# Altium schematic sheet RK3566_FLASH_SD_SARADC.SchDoc
size A3; SheetNumber: 17; SheetTotal: 20
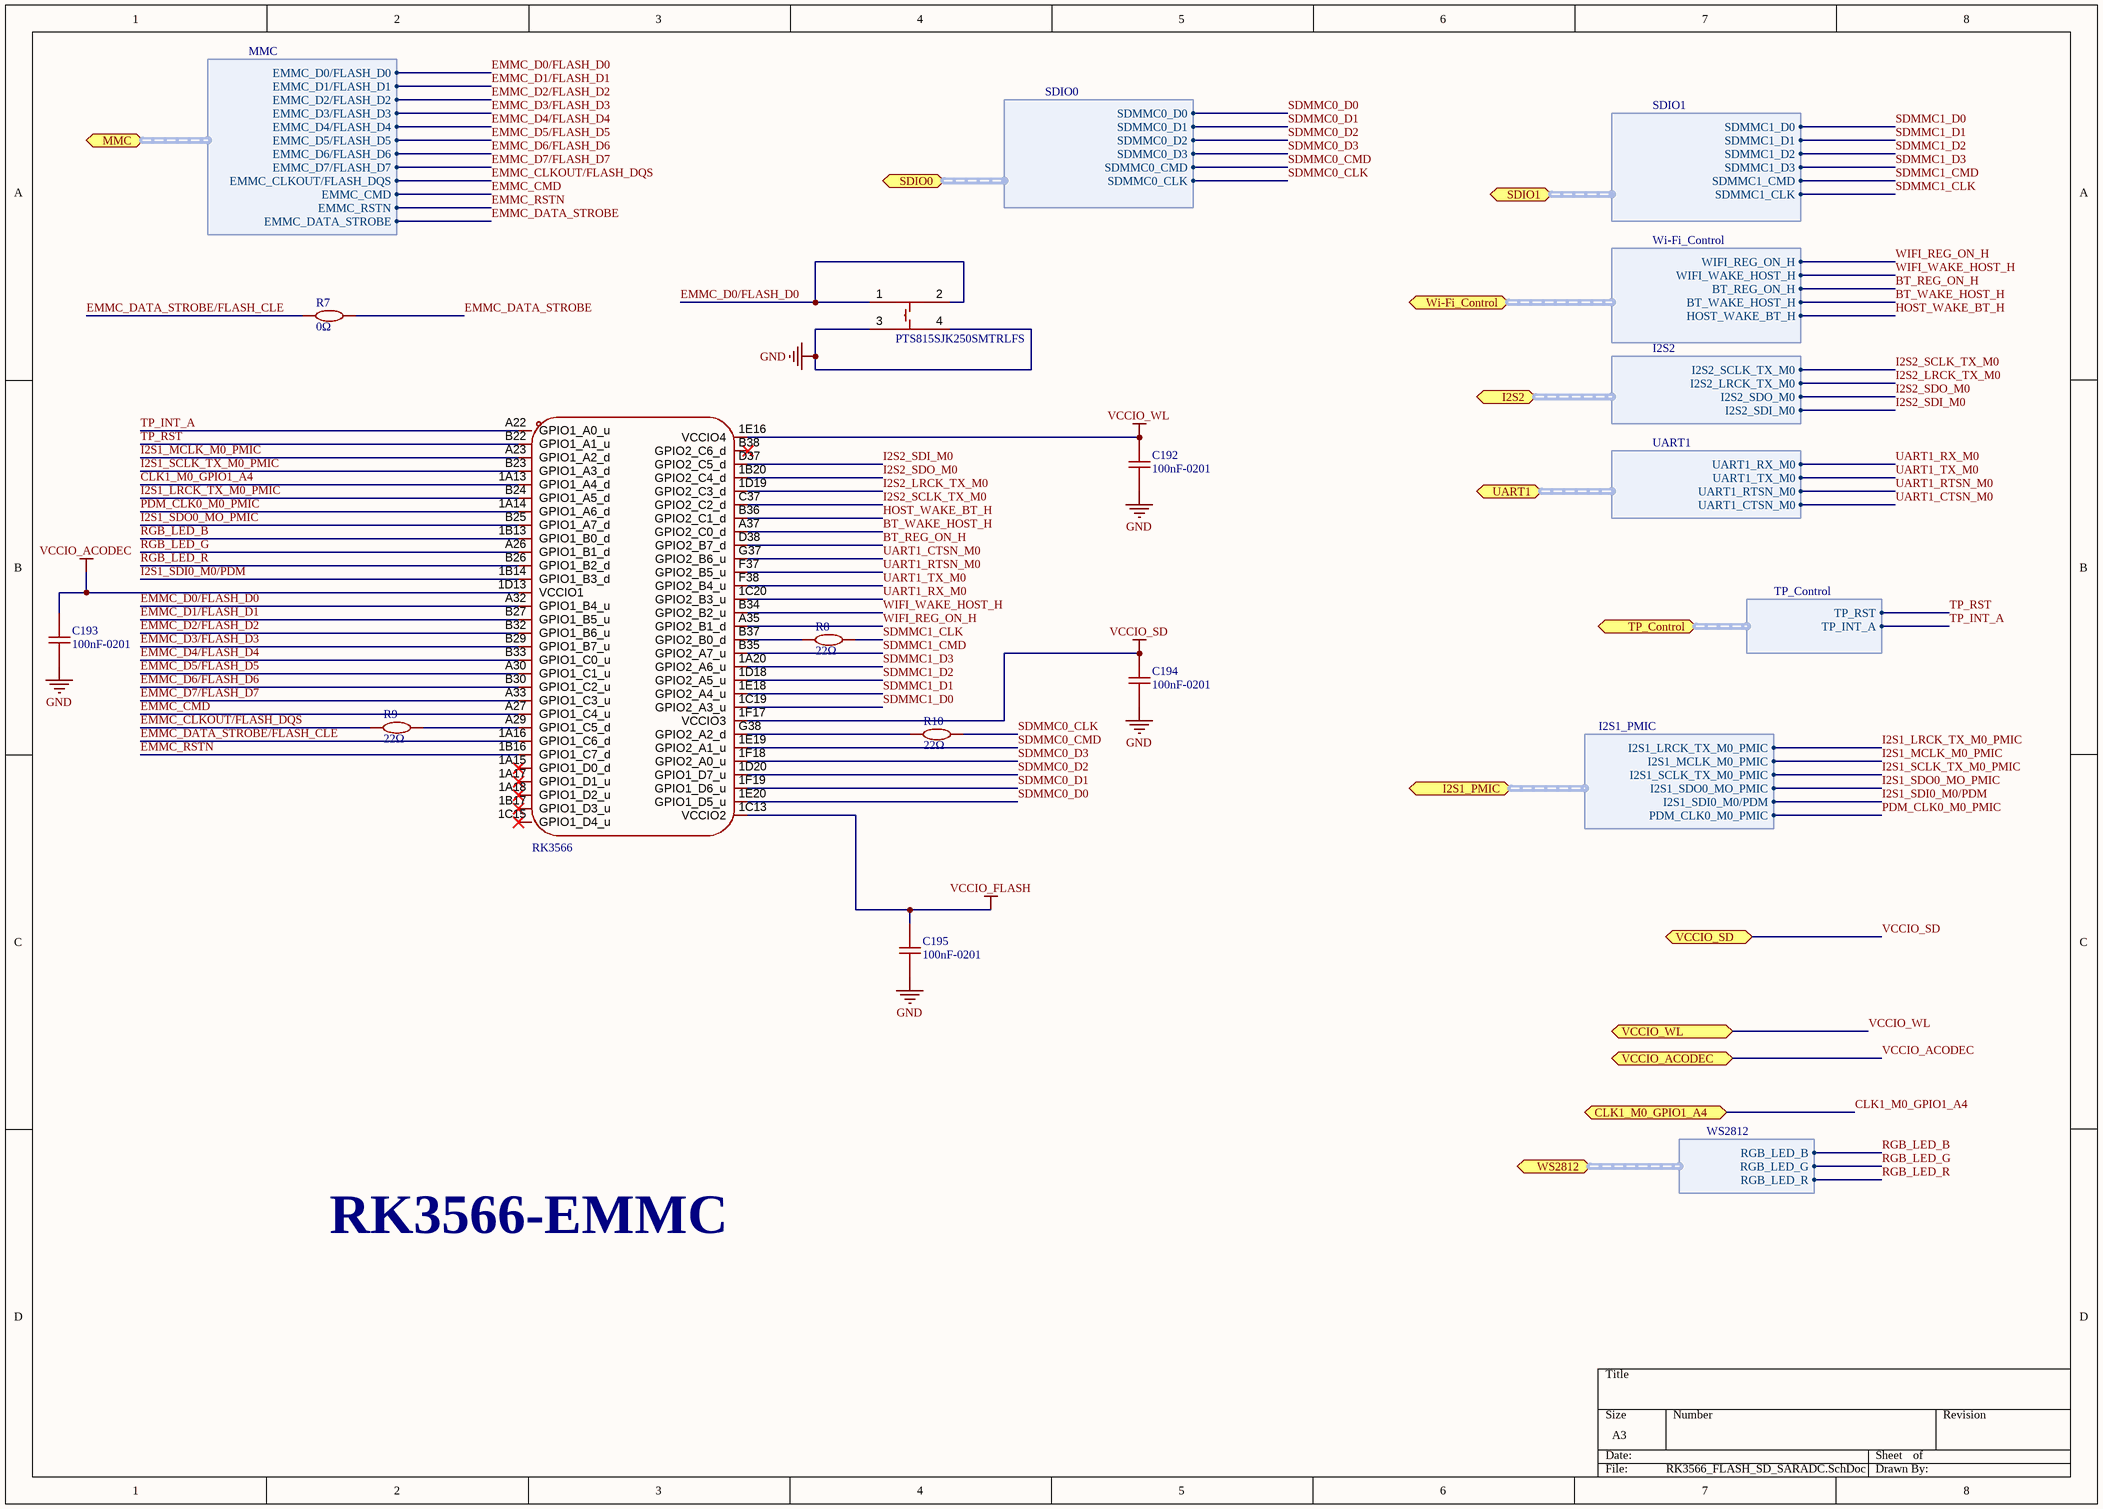
[diagram p0: RK3566_FLASH_SD_SARADC.SchDoc]

## Parts
C192  100nF-0201  [C0201]
C193  100nF-0201  [C0201]
C194  100nF-0201  [C0201]
C195  100nF-0201  [C0201]
R7  0Ω  [R0402]
R8  22Ω  [R0402]
R9  22Ω  [R0402]
R10  22Ω  [R0402]
SW4  PTS815SJK250SMTRLFS  [SW-SMD_4P-L4.2-W3.3-P2.15-LS5.1]
U2  RK3566  [BGA-565_L15.5-W14.4-P0.40_RK3566_1]  (part E of 8)

## Ports
CLK1_M0_GPIO1_A4 (bidir, see RK3566[1B], DEBUG_AND_GPIO[5A], RK3566[3B]), I2S1_PMIC (bidir, harness I2S1_PMIC, see RK3566[2B], POWER[2D], POWER_PMIC[3A], RK3566[3B]), I2S2 (bidir, harness I2S2, see RK3566[2B], RK3566[3B], Wi-Fi_BT[3B]), MMC (bidir, harness MMC, see RK3566[2B], EMMC_SD[3D], RK3566[3B]), SDIO0 (bidir, harness SDIO0, see RK3566[2B], EMMC_SD[6C], RK3566[3B]), SDIO1 (bidir, harness SDIO1, see RK3566[2B], RK3566[3B], Wi-Fi_BT[3A]), TP_Control (bidir, harness TP_Control, see RK3566[2B], MIPI_DSI_TP[2D], RK3566[3B]), UART1 (bidir, harness UARt1, see RK3566[2B], RK3566[3B], Wi-Fi_BT[6A]), VCCIO_ACODEC (bidir, see RK3566[2B], POWER[3D], POWER_PMIC[1D], RK3566[3B]), VCCIO_SD (bidir, see RK3566[2B], POWER[3D], POWER_PMIC[2D], RK3566[3B]), VCCIO_WL (bidir, see RK3566[2B], POWER[4D], POWER_EXTENSION[1A], POWER_PMIC[1D], POWER_PMIC[4A], RK3566[3B]), Wi-Fi_Control (bidir, harness Wi-Fi_Control, see RK3566[2B], RK3566[3B], Wi-Fi_BT[2A]), WS2812 (bidir, harness WS2812, see RK3566[1B], DEBUG_AND_GPIO[1C], RK3566[3B])

## Harnesses
MMC: EMMC_D0/FLASH_D0, EMMC_D1/FLASH_D1, EMMC_D2/FLASH_D2, EMMC_D3/FLASH_D3, EMMC_D4/FLASH_D4, EMMC_D5/FLASH_D5, EMMC_D6/FLASH_D6, EMMC_D7/FLASH_D7, EMMC_CLKOUT/FLASH_DQS, EMMC_CMD, EMMC_RSTN, EMMC_DATA_STROBE
SDIO0: SDMMC0_D0, SDMMC0_D1, SDMMC0_D2, SDMMC0_D3, SDMMC0_CMD, SDMMC0_CLK
SDIO1: SDMMC1_D0, SDMMC1_D1, SDMMC1_D2, SDMMC1_D3, SDMMC1_CMD, SDMMC1_CLK
Wi-Fi_Control: WIFI_REG_ON_H, WIFI_WAKE_HOST_H, BT_REG_ON_H, BT_WAKE_HOST_H, HOST_WAKE_BT_H
I2S2: I2S2_SCLK_TX_M0, I2S2_LRCK_TX_M0, I2S2_SDO_M0, I2S2_SDI_M0
UART1: UART1_RX_M0, UART1_TX_M0, UART1_RTSN_M0, UART1_CTSN_M0
TP_Control: TP_RST, TP_INT_A
I2S1_PMIC: I2S1_MCLK_M0_PMIC, I2S1_SCLK_TX_M0_PMIC, I2S1_SDO0_MO_PMIC, I2S1_SDI0_M0/PDM, I2S1_LRCK_TX_M0_PMIC, PDM_CLK0_M0_PMIC
WS2812: RGB_LED_B, RGB_LED_G, RGB_LED_R

## Nets
GND: C192.1 C193.1 C194.1 C195.1 SW4.3 SW4.4
VCCIO_ACODEC: C193.2 U2.1D13(VCCIO1) ; port VCCIO_ACODEC
VCCIO_FLASH: C195.2 U2.1C13(VCCIO2)
VCCIO_SD: C194.2 U2.1F17(VCCIO3) ; port VCCIO_SD
VCCIO_WL: C192.2 U2.1E16(VCCIO4) ; port VCCIO_WL
BT_REG_ON_H: U2.D38(GPIO2_B7_d) ; port Wi-Fi_Control.BT_REG_ON_H
BT_WAKE_HOST_H: U2.A37(GPIO2_C0_d) ; port Wi-Fi_Control.BT_WAKE_HOST_H
CLK1_M0_GPIO1_A4: U2.1A13(GPIO1_A4_d) ; port CLK1_M0_GPIO1_A4
EMMC_CLKOUT/FLASH_DQS: R9.1 ; port MMC.EMMC_CLKOUT/FLASH_DQS
EMMC_CMD: U2.A27(GPIO1_C4_u) ; port MMC.EMMC_CMD
EMMC_D0/FLASH_D0: SW4.1 SW4.2 U2.A32(GPIO1_B4_u) ; port MMC.EMMC_D0/FLASH_D0
EMMC_D1/FLASH_D1: U2.B27(GPIO1_B5_u) ; port MMC.EMMC_D1/FLASH_D1
EMMC_D2/FLASH_D2: U2.B32(GPIO1_B6_u) ; port MMC.EMMC_D2/FLASH_D2
EMMC_D3/FLASH_D3: U2.B29(GPIO1_B7_u) ; port MMC.EMMC_D3/FLASH_D3
EMMC_D4/FLASH_D4: U2.B33(GPIO1_C0_u) ; port MMC.EMMC_D4/FLASH_D4
EMMC_D5/FLASH_D5: U2.A30(GPIO1_C1_u) ; port MMC.EMMC_D5/FLASH_D5
EMMC_D6/FLASH_D6: U2.B30(GPIO1_C2_u) ; port MMC.EMMC_D6/FLASH_D6
EMMC_D7/FLASH_D7: U2.A33(GPIO1_C3_u) ; port MMC.EMMC_D7/FLASH_D7
EMMC_DATA_STROBE: R7.2 ; port MMC.EMMC_DATA_STROBE
EMMC_DATA_STROBE/FLASH_CLE: R7.1 U2.1A16(GPIO1_C6_d)
EMMC_RSTN: U2.1B16(GPIO1_C7_d) ; port MMC.EMMC_RSTN
HOST_WAKE_BT_H: U2.B36(GPIO2_C1_d) ; port Wi-Fi_Control.HOST_WAKE_BT_H
I2S1_LRCK_TX_M0_PMIC: U2.B24(GPIO1_A5_d) ; port I2S1_PMIC.I2S1_LRCK_TX_M0_PMIC
I2S1_MCLK_M0_PMIC: U2.A23(GPIO1_A2_d) ; port I2S1_PMIC.I2S1_MCLK_M0_PMIC
I2S1_SCLK_TX_M0_PMIC: U2.B23(GPIO1_A3_d) ; port I2S1_PMIC.I2S1_SCLK_TX_M0_PMIC
I2S1_SDI0_M0/PDM: U2.1B14(GPIO1_B3_d) ; port I2S1_PMIC.I2S1_SDI0_M0/PDM
I2S1_SDO0_MO_PMIC: U2.B25(GPIO1_A7_d) ; port I2S1_PMIC.I2S1_SDO0_MO_PMIC
I2S2_LRCK_TX_M0: U2.1D19(GPIO2_C3_d) ; port I2S2.I2S2_LRCK_TX_M0
I2S2_SCLK_TX_M0: U2.C37(GPIO2_C2_d) ; port I2S2.I2S2_SCLK_TX_M0
I2S2_SDI_M0: U2.D37(GPIO2_C5_d) ; port I2S2.I2S2_SDI_M0
I2S2_SDO_M0: U2.1B20(GPIO2_C4_d) ; port I2S2.I2S2_SDO_M0
PDM_CLK0_M0_PMIC: U2.1A14(GPIO1_A6_d) ; port I2S1_PMIC.PDM_CLK0_M0_PMIC
RGB_LED_B: U2.1B13(GPIO1_B0_d) ; port WS2812.RGB_LED_B
RGB_LED_G: U2.A26(GPIO1_B1_d) ; port WS2812.RGB_LED_G
RGB_LED_R: U2.B26(GPIO1_B2_d) ; port WS2812.RGB_LED_R
SDMMC0_CLK: R10.2 ; port SDIO0.SDMMC0_CLK
SDMMC0_CMD: U2.1E19(GPIO2_A1_u) ; port SDIO0.SDMMC0_CMD
SDMMC0_D0: U2.1E20(GPIO1_D5_u) ; port SDIO0.SDMMC0_D0
SDMMC0_D1: U2.1F19(GPIO1_D6_u) ; port SDIO0.SDMMC0_D1
SDMMC0_D2: U2.1D20(GPIO1_D7_u) ; port SDIO0.SDMMC0_D2
SDMMC0_D3: U2.1F18(GPIO2_A0_u) ; port SDIO0.SDMMC0_D3
SDMMC1_CLK: R8.2 ; port SDIO1.SDMMC1_CLK
SDMMC1_CMD: U2.B35(GPIO2_A7_u) ; port SDIO1.SDMMC1_CMD
SDMMC1_D0: U2.1C19(GPIO2_A3_u) ; port SDIO1.SDMMC1_D0
SDMMC1_D1: U2.1E18(GPIO2_A4_u) ; port SDIO1.SDMMC1_D1
SDMMC1_D2: U2.1D18(GPIO2_A5_u) ; port SDIO1.SDMMC1_D2
SDMMC1_D3: U2.1A20(GPIO2_A6_u) ; port SDIO1.SDMMC1_D3
TP_INT_A: U2.A22(GPIO1_A0_u) ; port TP_Control.TP_INT_A
TP_RST: U2.B22(GPIO1_A1_u) ; port TP_Control.TP_RST
UART1_CTSN_M0: U2.G37(GPIO2_B6_u) ; port UART1.UART1_CTSN_M0
UART1_RTSN_M0: U2.F37(GPIO2_B5_u) ; port UART1.UART1_RTSN_M0
UART1_RX_M0: U2.1C20(GPIO2_B3_u) ; port UART1.UART1_RX_M0
UART1_TX_M0: U2.F38(GPIO2_B4_u) ; port UART1.UART1_TX_M0
WIFI_REG_ON_H: U2.A35(GPIO2_B1_d) ; port Wi-Fi_Control.WIFI_REG_ON_H
WIFI_WAKE_HOST_H: U2.B34(GPIO2_B2_u) ; port Wi-Fi_Control.WIFI_WAKE_HOST_H
NetR8_1: R8.1 U2.B37(GPIO2_B0_d)
NetR9_2: R9.2 U2.A29(GPIO1_C5_d)
NetR10_1: R10.1 U2.G38(GPIO2_A2_d)

Not connected (* = marked no-connect by the designer): U2 1A15(GPIO1_D0_d)* 1A17(GPIO1_D1_u)* 1A18(GPIO1_D2_u)* 1B17(GPIO1_D3_u)* 1C15(GPIO1_D4_u)* B38(GPIO2_C6_d)*

## Notes on the sheet
- RK3566-EMMC

## Library data of the parts
C192-C195 = 100nF-0201: CL03A104KO3NNNC
R7 = 0Ω: 0Ω 62.5mW 50V Thick Film Resistor ±1% 0402 Chip Resistor - Surface Mount ROHS
R8-R10 = 22Ω: 62.5mW 33Ω 50V ±100ppm/℃ Thick Film Resistor ±1% 0402 Chip Resistor - Surface Mount ROHS
SW4 = PTS815SJK250SMTRLFS: 4pin 轻触开关 SMD​; Symbol: PTS815SJK250SMTRLFS
U2 = RK3566: BGA-565(15.5x14.4); Symbol: RK3566